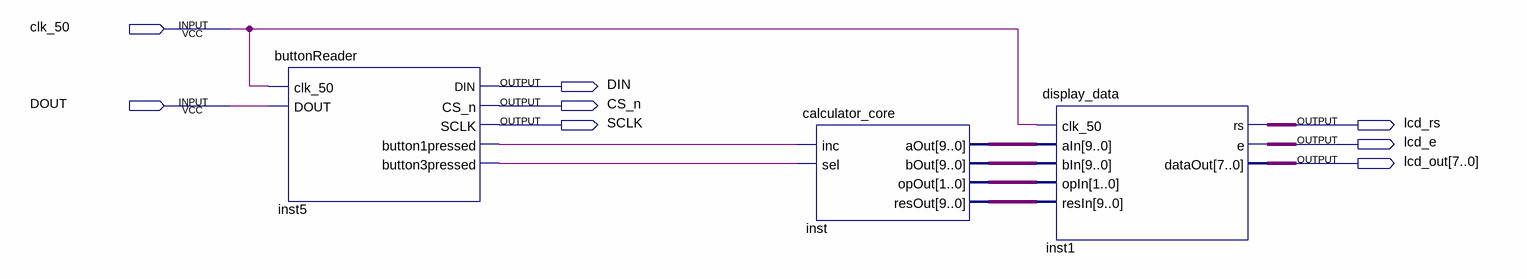
[diagram p0: schematic sheet]
// Quartus schematic calculator.bdf as structural Verilog: 3 symbols, 8 pins
module calculator (
  input  clk_50,
  input  DOUT,
  output DIN,
  output CS_n,
  output SCLK,
  output lcd_rs,
  output lcd_e,
  output [7:0] lcd_out
);

  wire inst5_button1pressed, inst5_button3pressed;
  wire [1:0] inst_opout;
  wire [9:0] inst_aout, inst_bout, inst_resout;

  buttonReader inst5 (
    .clk_50(clk_50), .DOUT(DOUT), .DIN(DIN), .CS_n(CS_n), .SCLK(SCLK), .button1pressed(inst5_button1pressed),
    .button3pressed(inst5_button3pressed));
  calculator_core inst (
    .inc(inst5_button1pressed), .sel(inst5_button3pressed), .aOut(inst_aout), .bOut(inst_bout),
    .opOut(inst_opout), .resOut(inst_resout));
  display_data inst1 (
    .clk_50(clk_50), .aIn(inst_aout), .bIn(inst_bout), .opIn(inst_opout), .resIn(inst_resout), .rs(lcd_rs),
    .e(lcd_e), .dataOut(lcd_out));
endmodule
